# EasyEDA schematic Schematic  .json
TITLE: Prathyum G U25UV23T040073; REV: 1.0; Date: 2026-04-10; Sheet: 1/1; Drawn By: prathyum; Company: Your Company
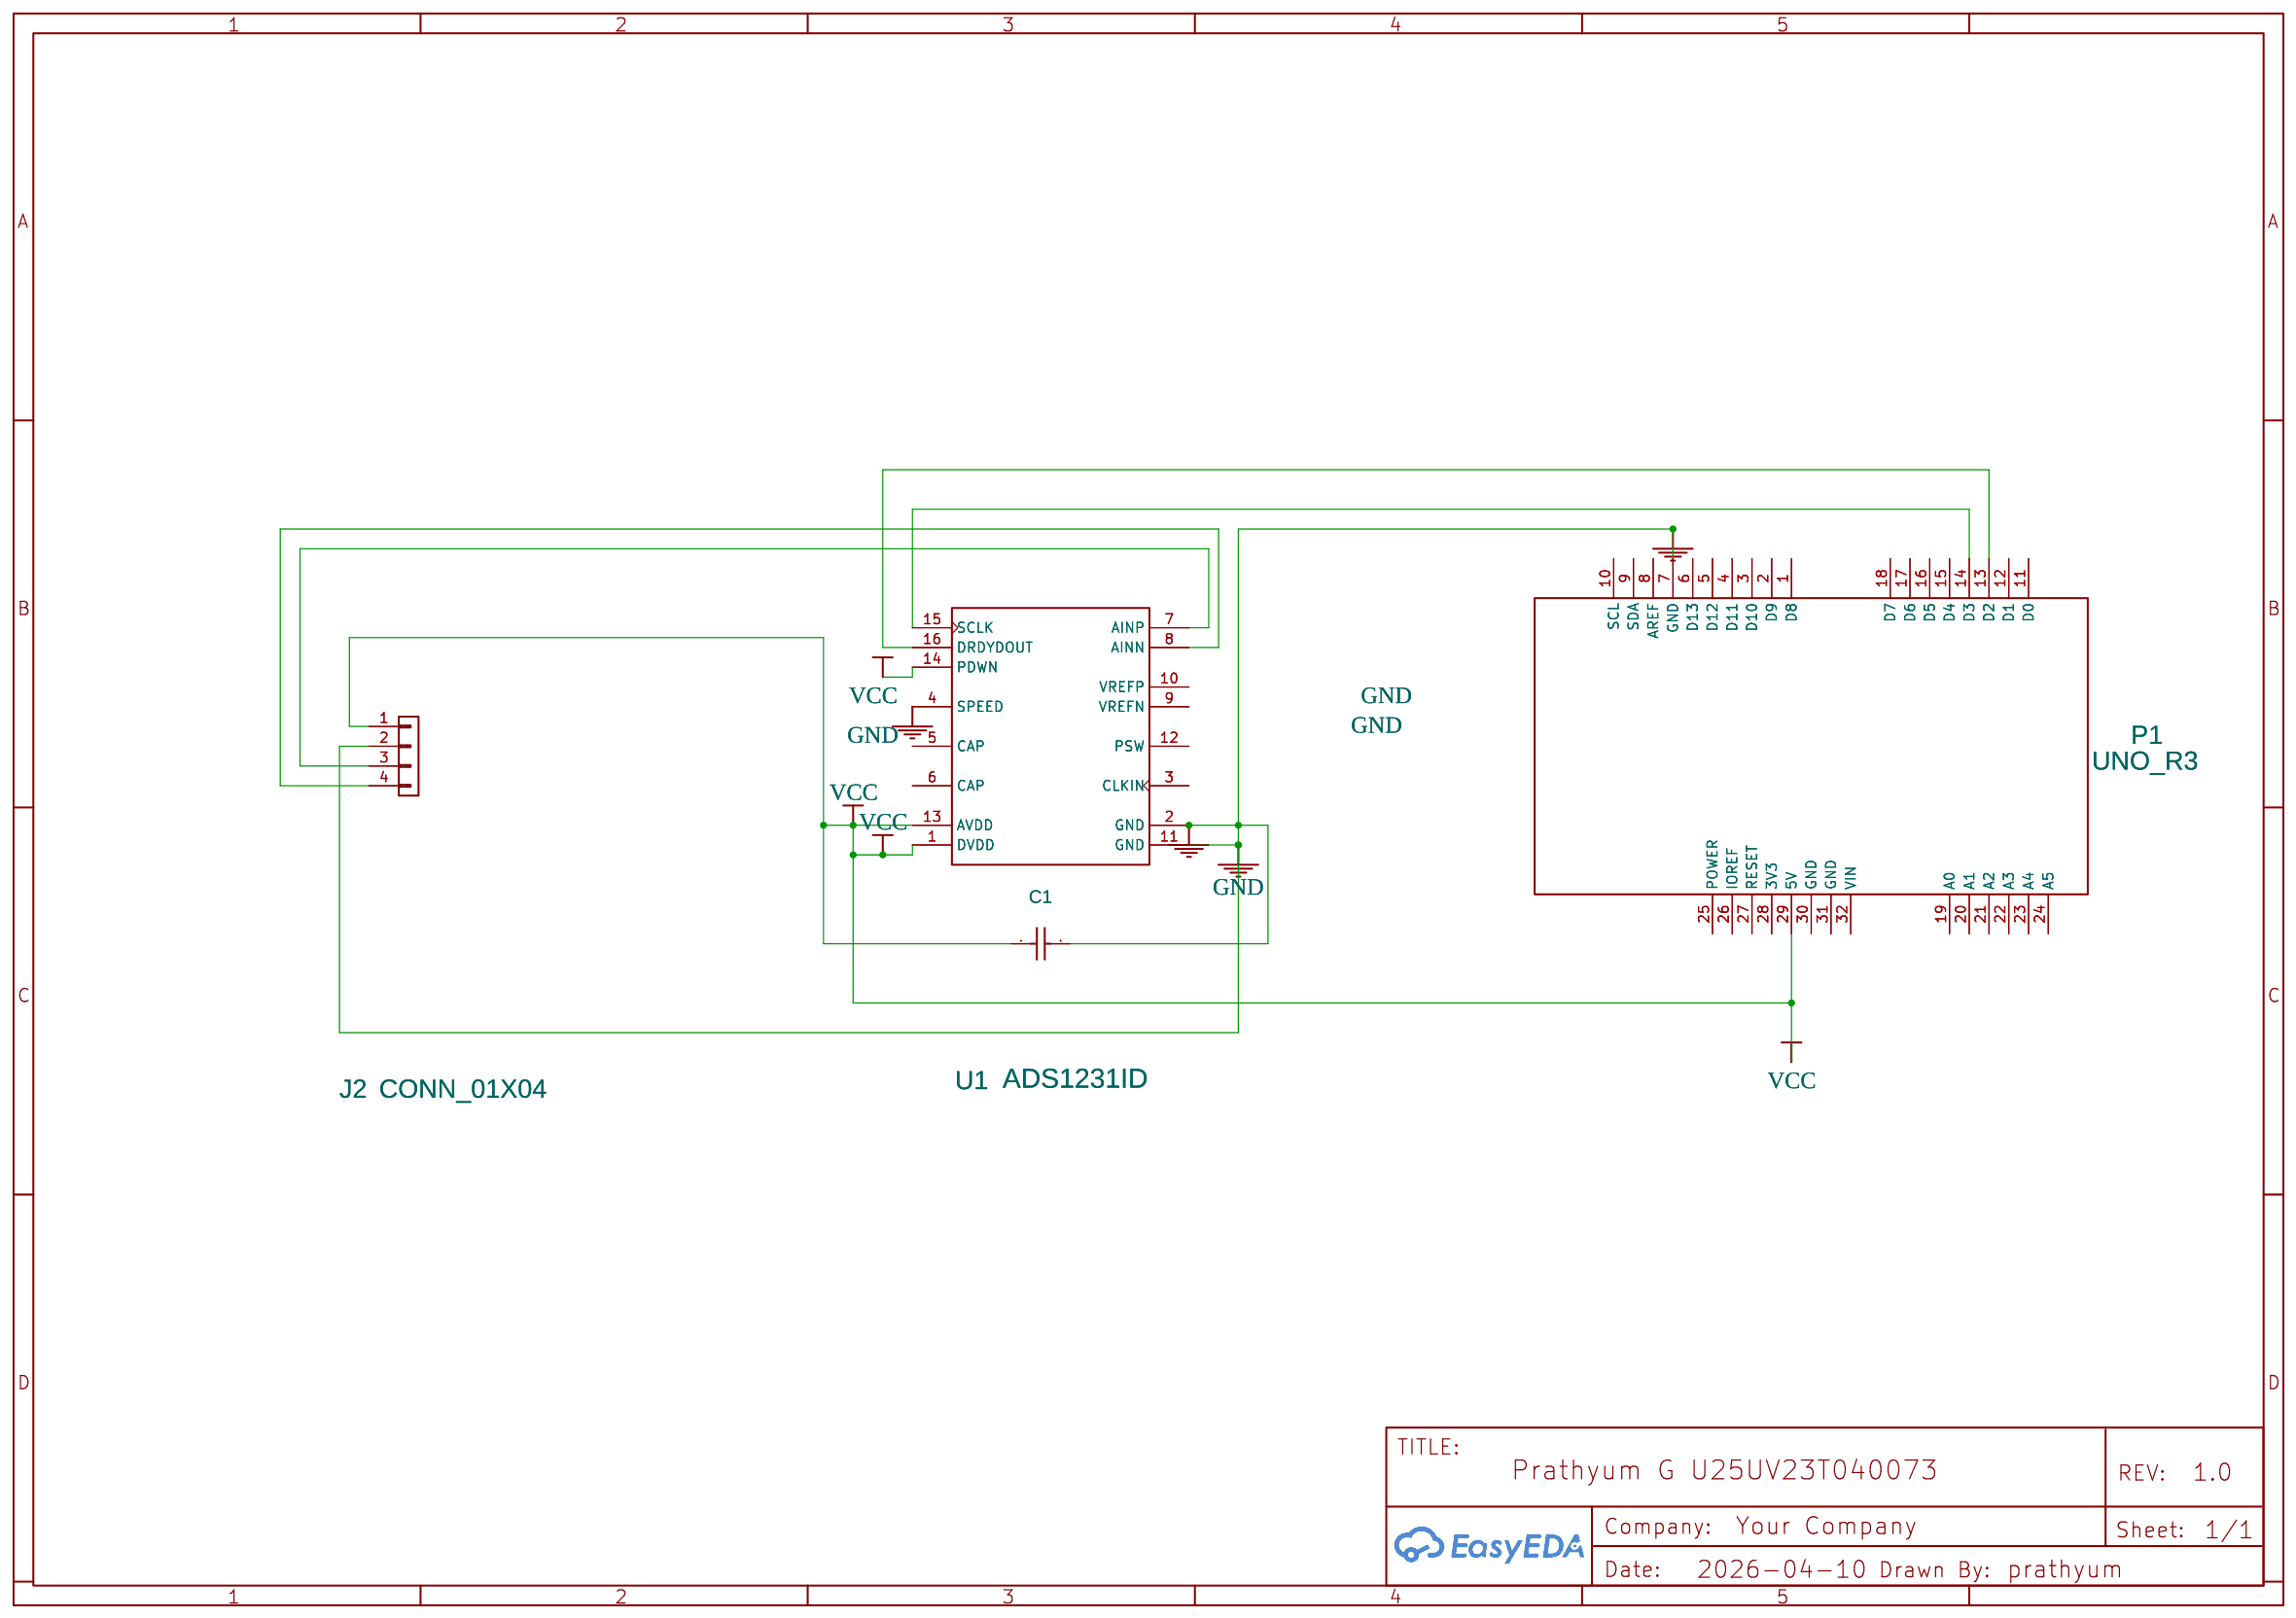
[diagram p0: schematic sheet]

## Parts
C1  100nF  [CAP-CBB-11.0*4.0]
J2  CONN_01X04  [ADS1231]
P1  UNO_R3  [UNO_R3]
U1  ADS1231ID  [SOIC16N]

## Library data of the parts
C1 = 104J 40OV: Supplier Part: undefined; Supplier: LCSC; Manufacturer: ReliaPro
J2 = CONN_01X04: Contributor: KiCAD; license: https://www.gnu.org/licenses/lgpl-2.1.html
P1 = UNO_R3: sourceId: 1T5FDZYC8
U1 = ADS1231ID: Low-Noise, 24-Bit ADC, -40 to 85 degC, 16-pin SOIC (D16), Green (RoHS  no SbBr)

## Nets
GND: C1.2 J2.2(P2) P1.7(GND) U1.2(GND) U1.4(SPEED) U1.11(GND)
VCC: C1.1 J2.1(P1) P1.29(5V) U1.1(DVDD) U1.13(AVDD) U1.14(PDWN)
Net-(J2-3): J2.3(P3) U1.7(AINP)
Net-(J2-4): J2.4(P4) U1.8(AINN)
Net-(P1-13): P1.13(D2) U1.16(DRDYDOUT)
Net-(P1-14): P1.14(D3) U1.15(SCLK)

Not connected (* = marked no-connect by the designer): P1 1(D8) 2(D9) 3(D10) 4(D11) 5(D12) 6(D13) 8(AREF) 9(SDA) 10(SCL) 11(D0) 12(D1) 15(D4) 16(D5) 17(D6) 18(D7) 19(A0) 20(A1) 21(A2) 22(A3) 23(A4) 24(A5) 25(POWER) 26(IOREF) 27(RESET) 28(3V3) 30(GND) 31(GND) 32(VIN); U1 3(CLKIN) 5(CAP) 6(CAP) 9(VREFN) 10(VREFP) 12(PSW)
